# EAGLE board oresat-live-card (EAGLE 9.6.2), part 1 of 2
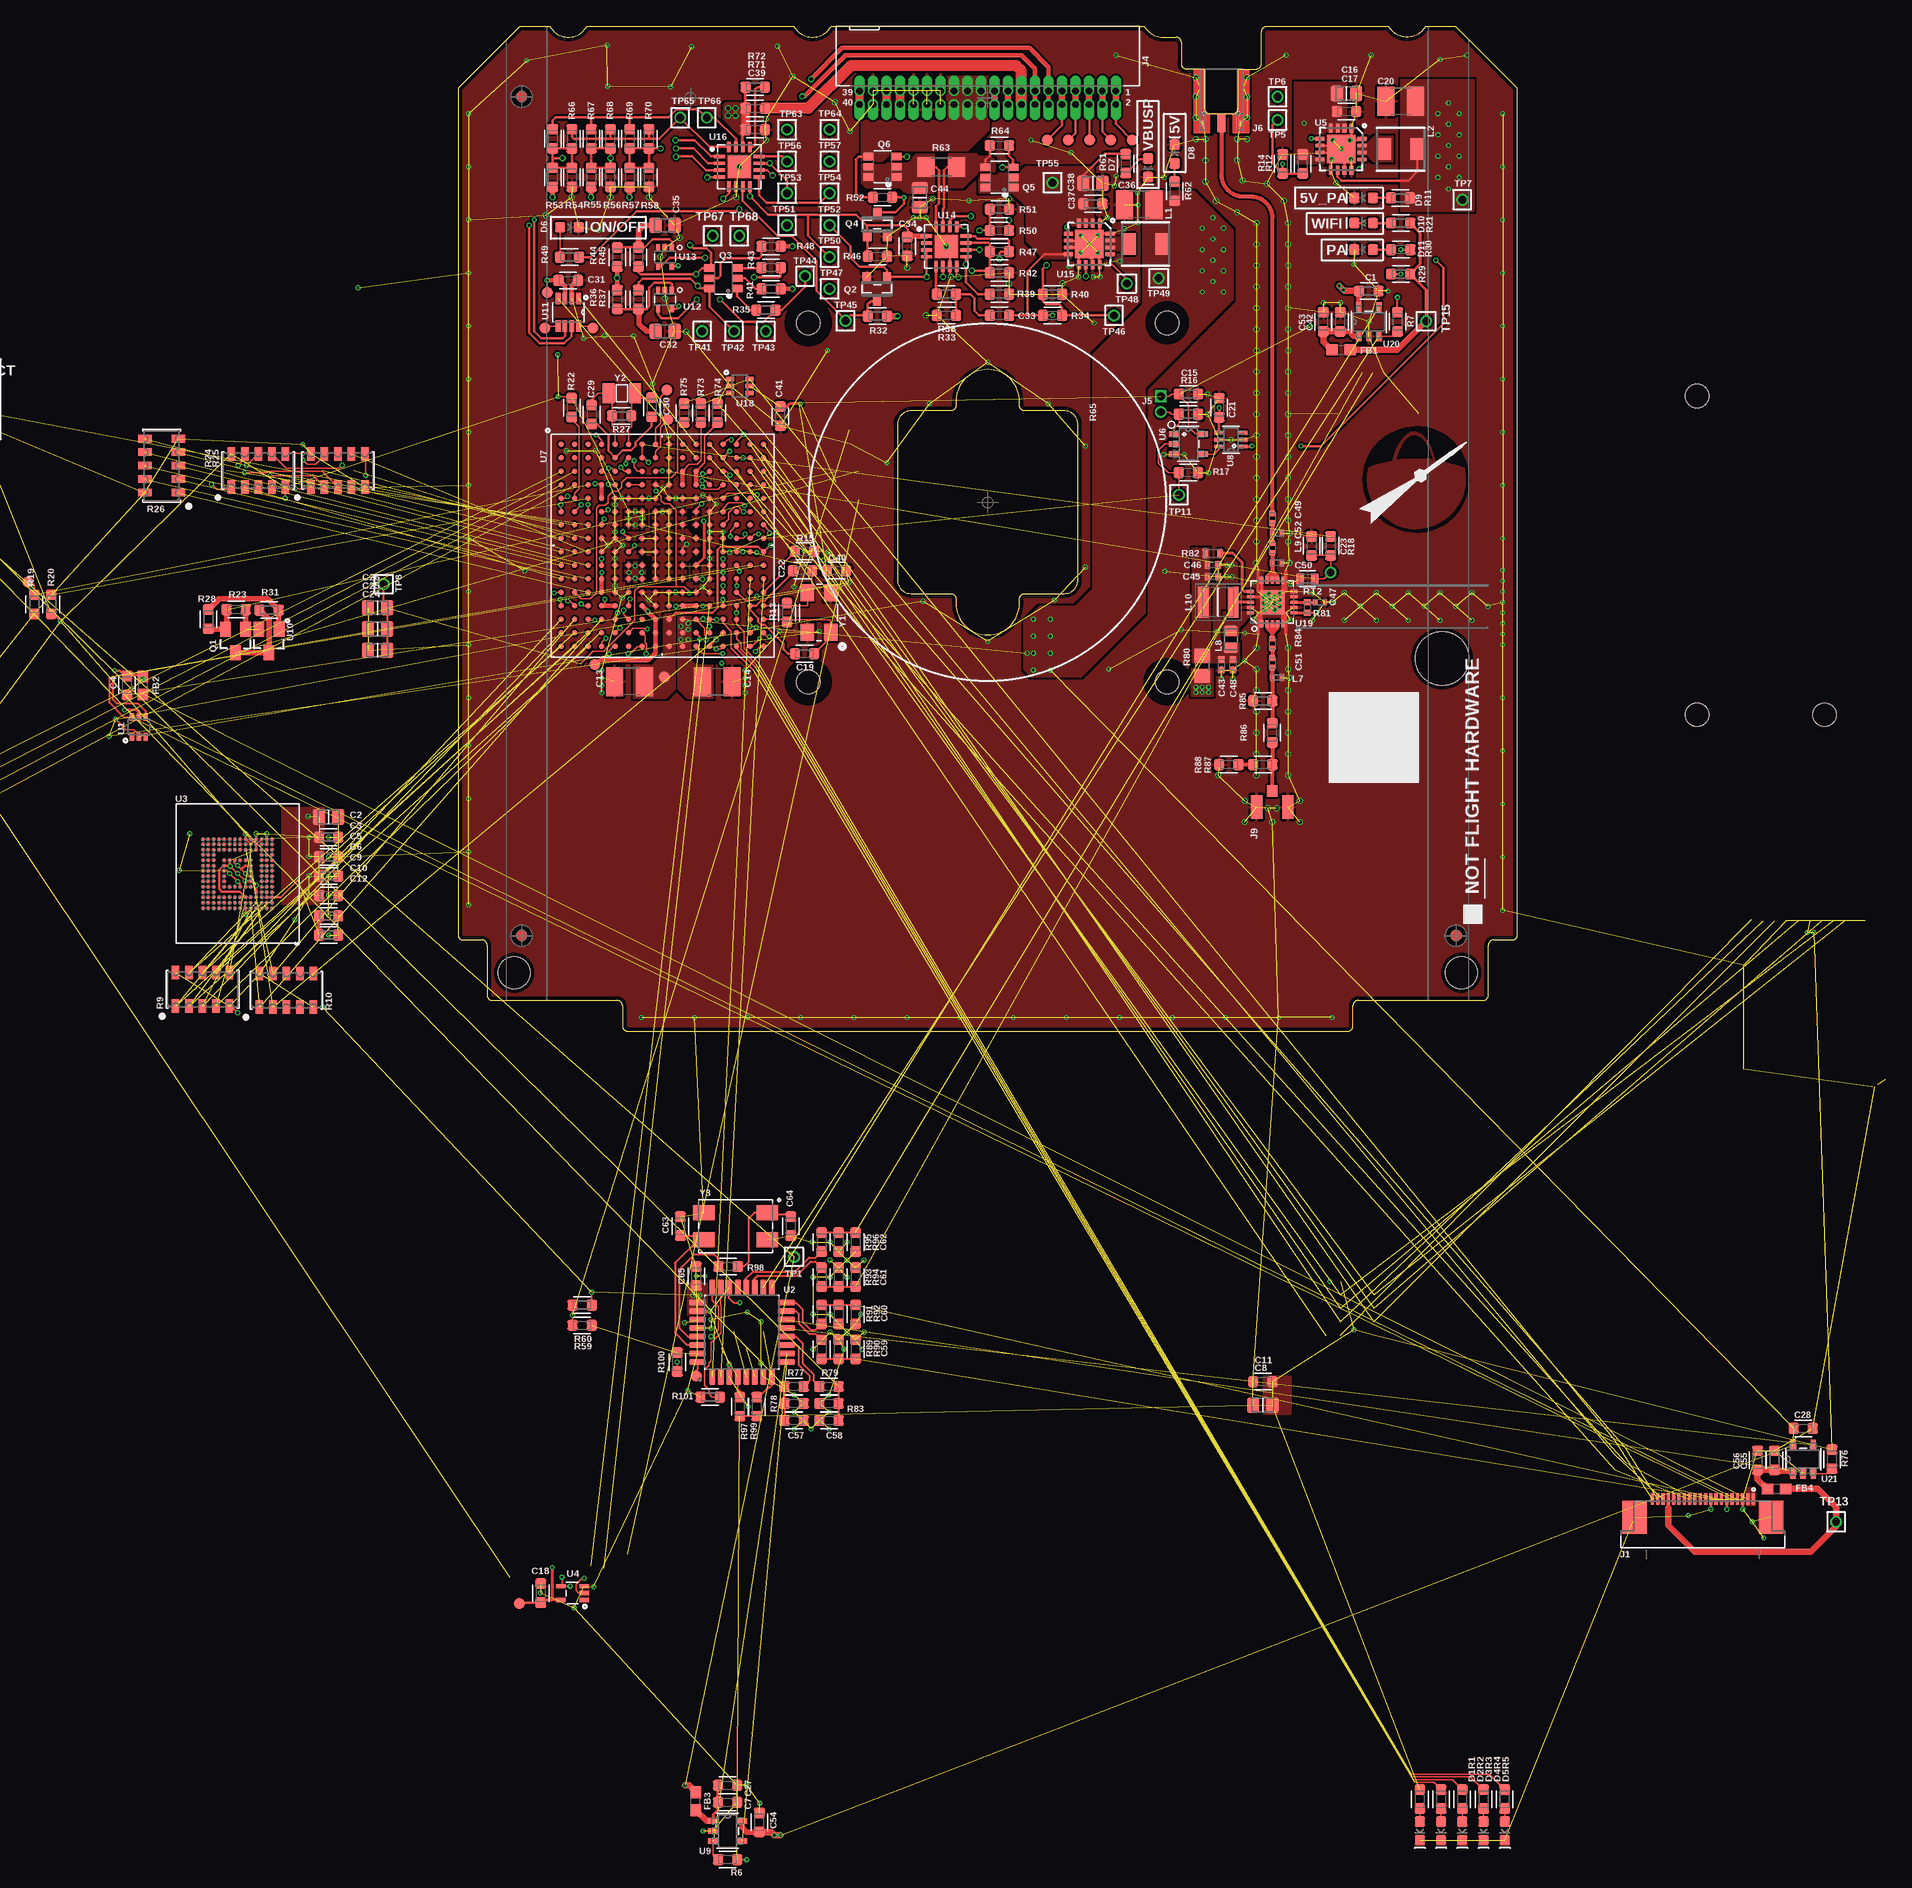
[diagram p11: board, top side]
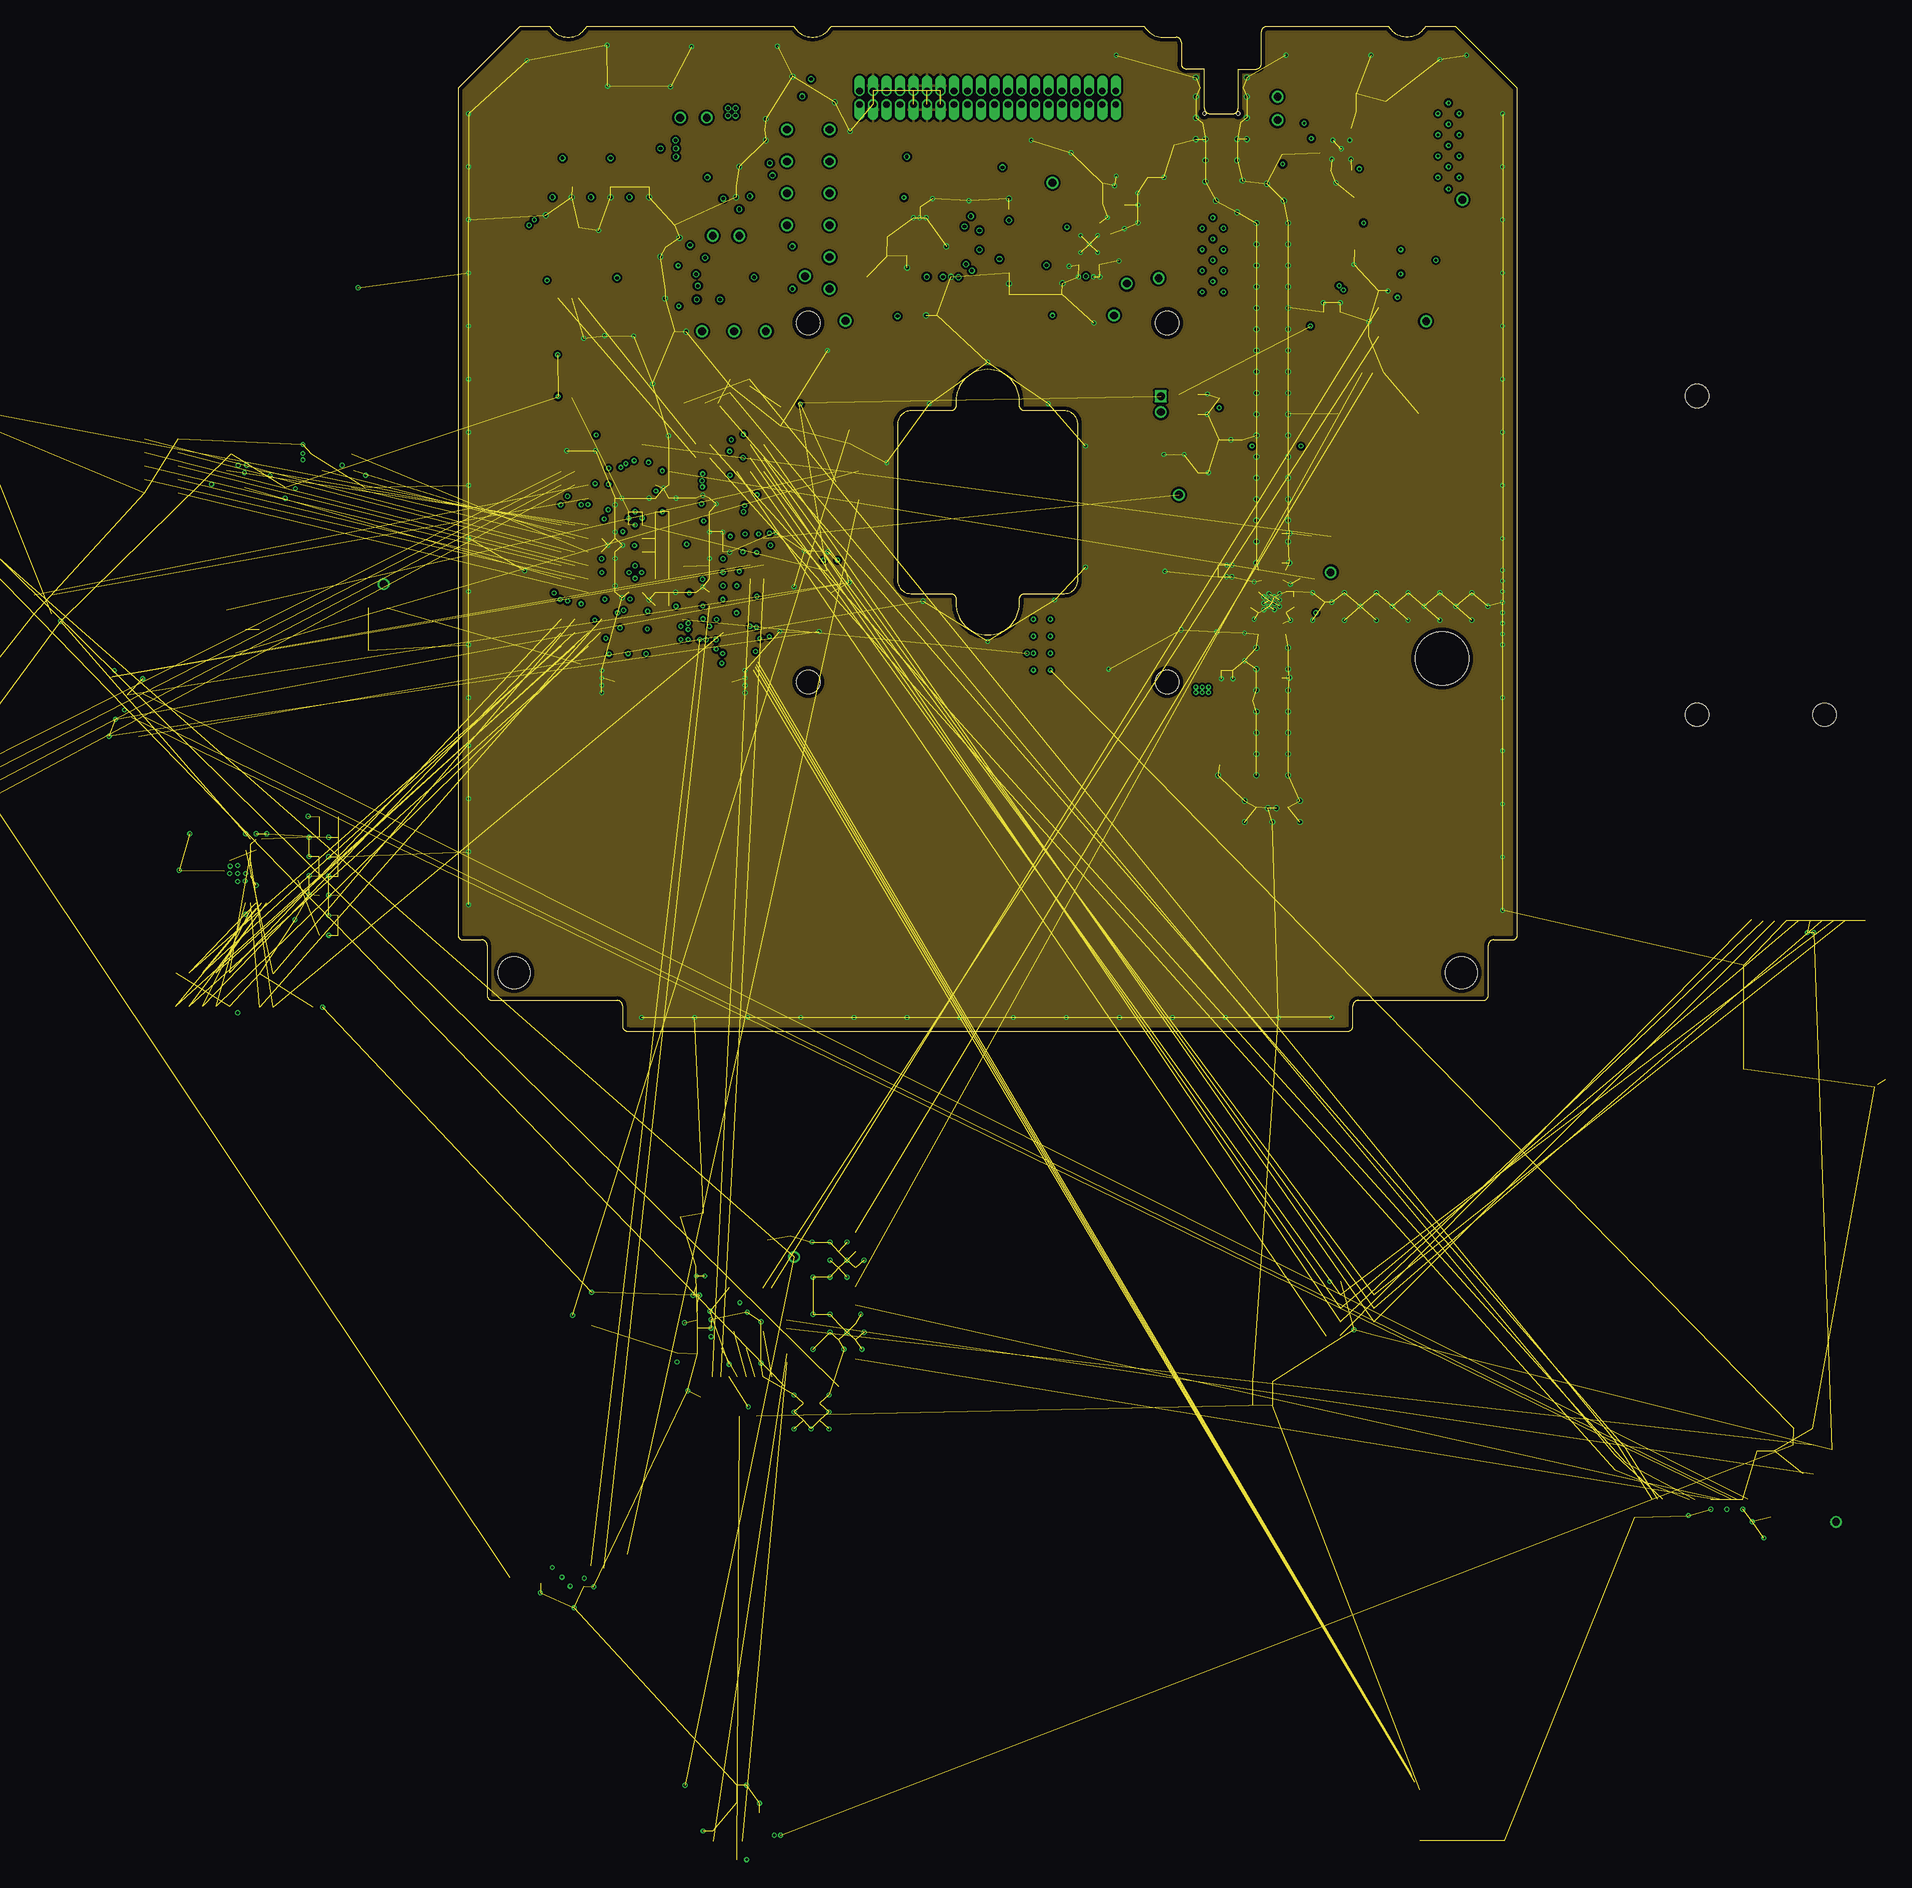
[diagram p12: board, inner layer Route2]
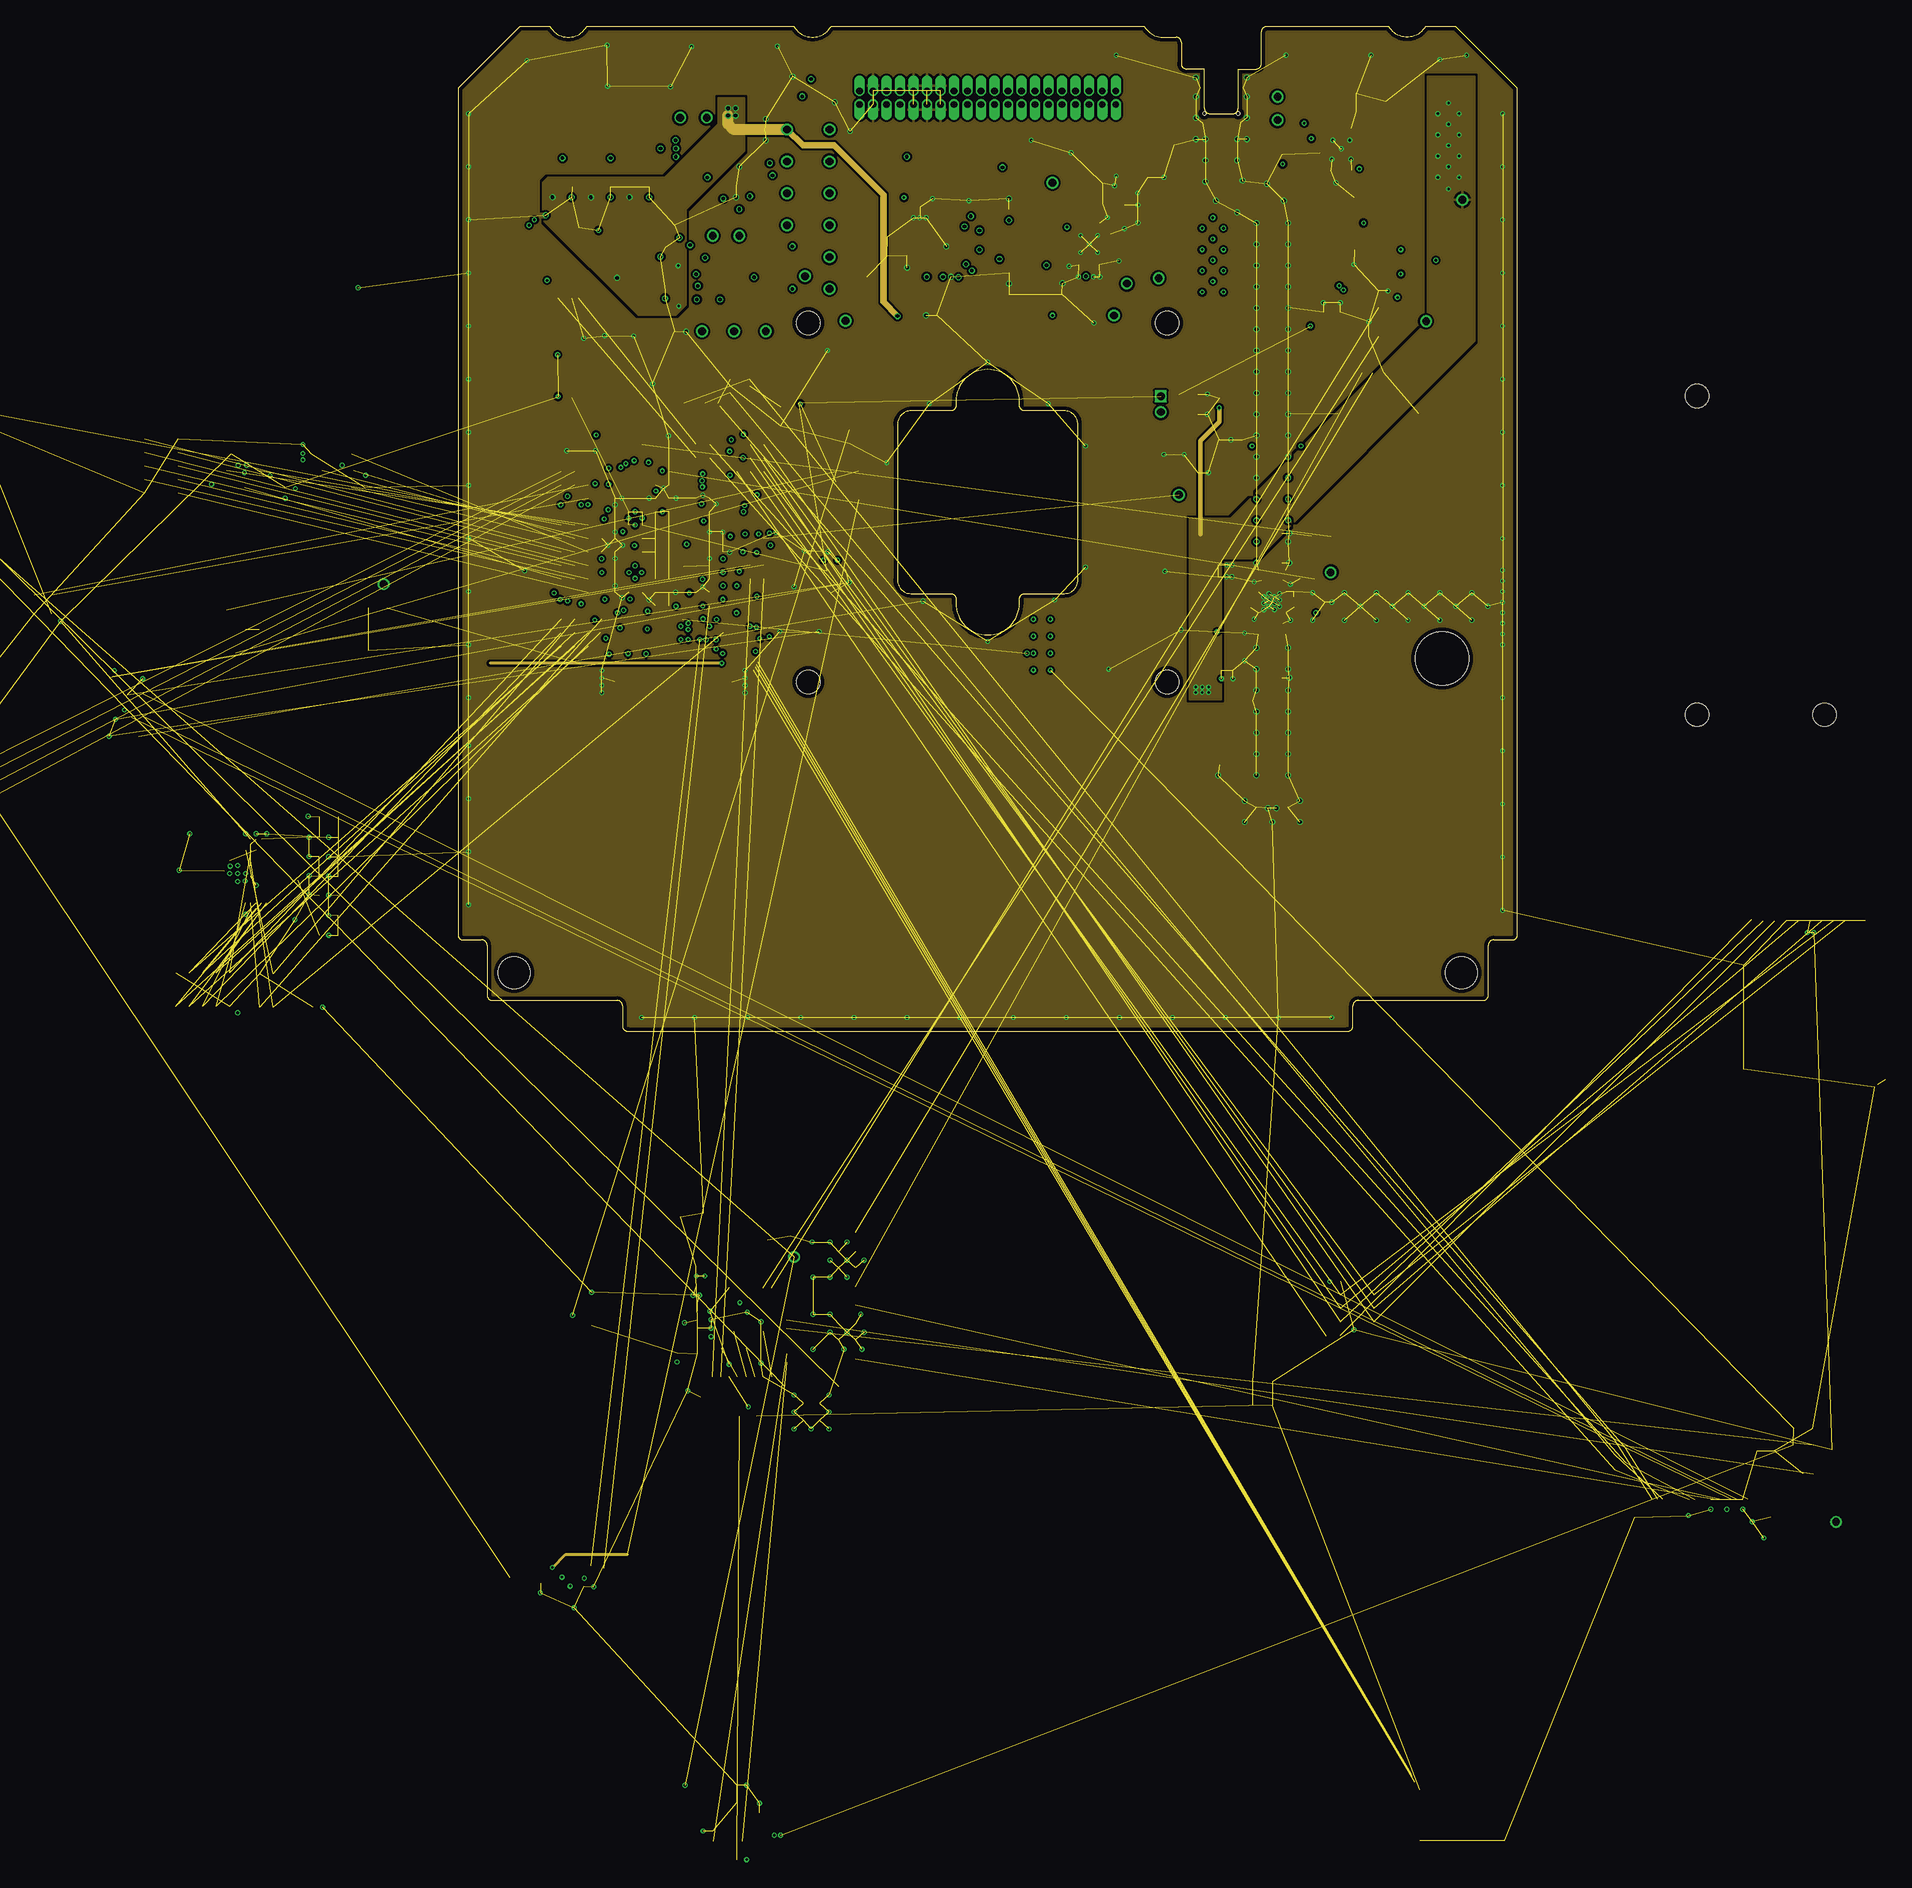
[diagram p13: board, inner layer Route15]
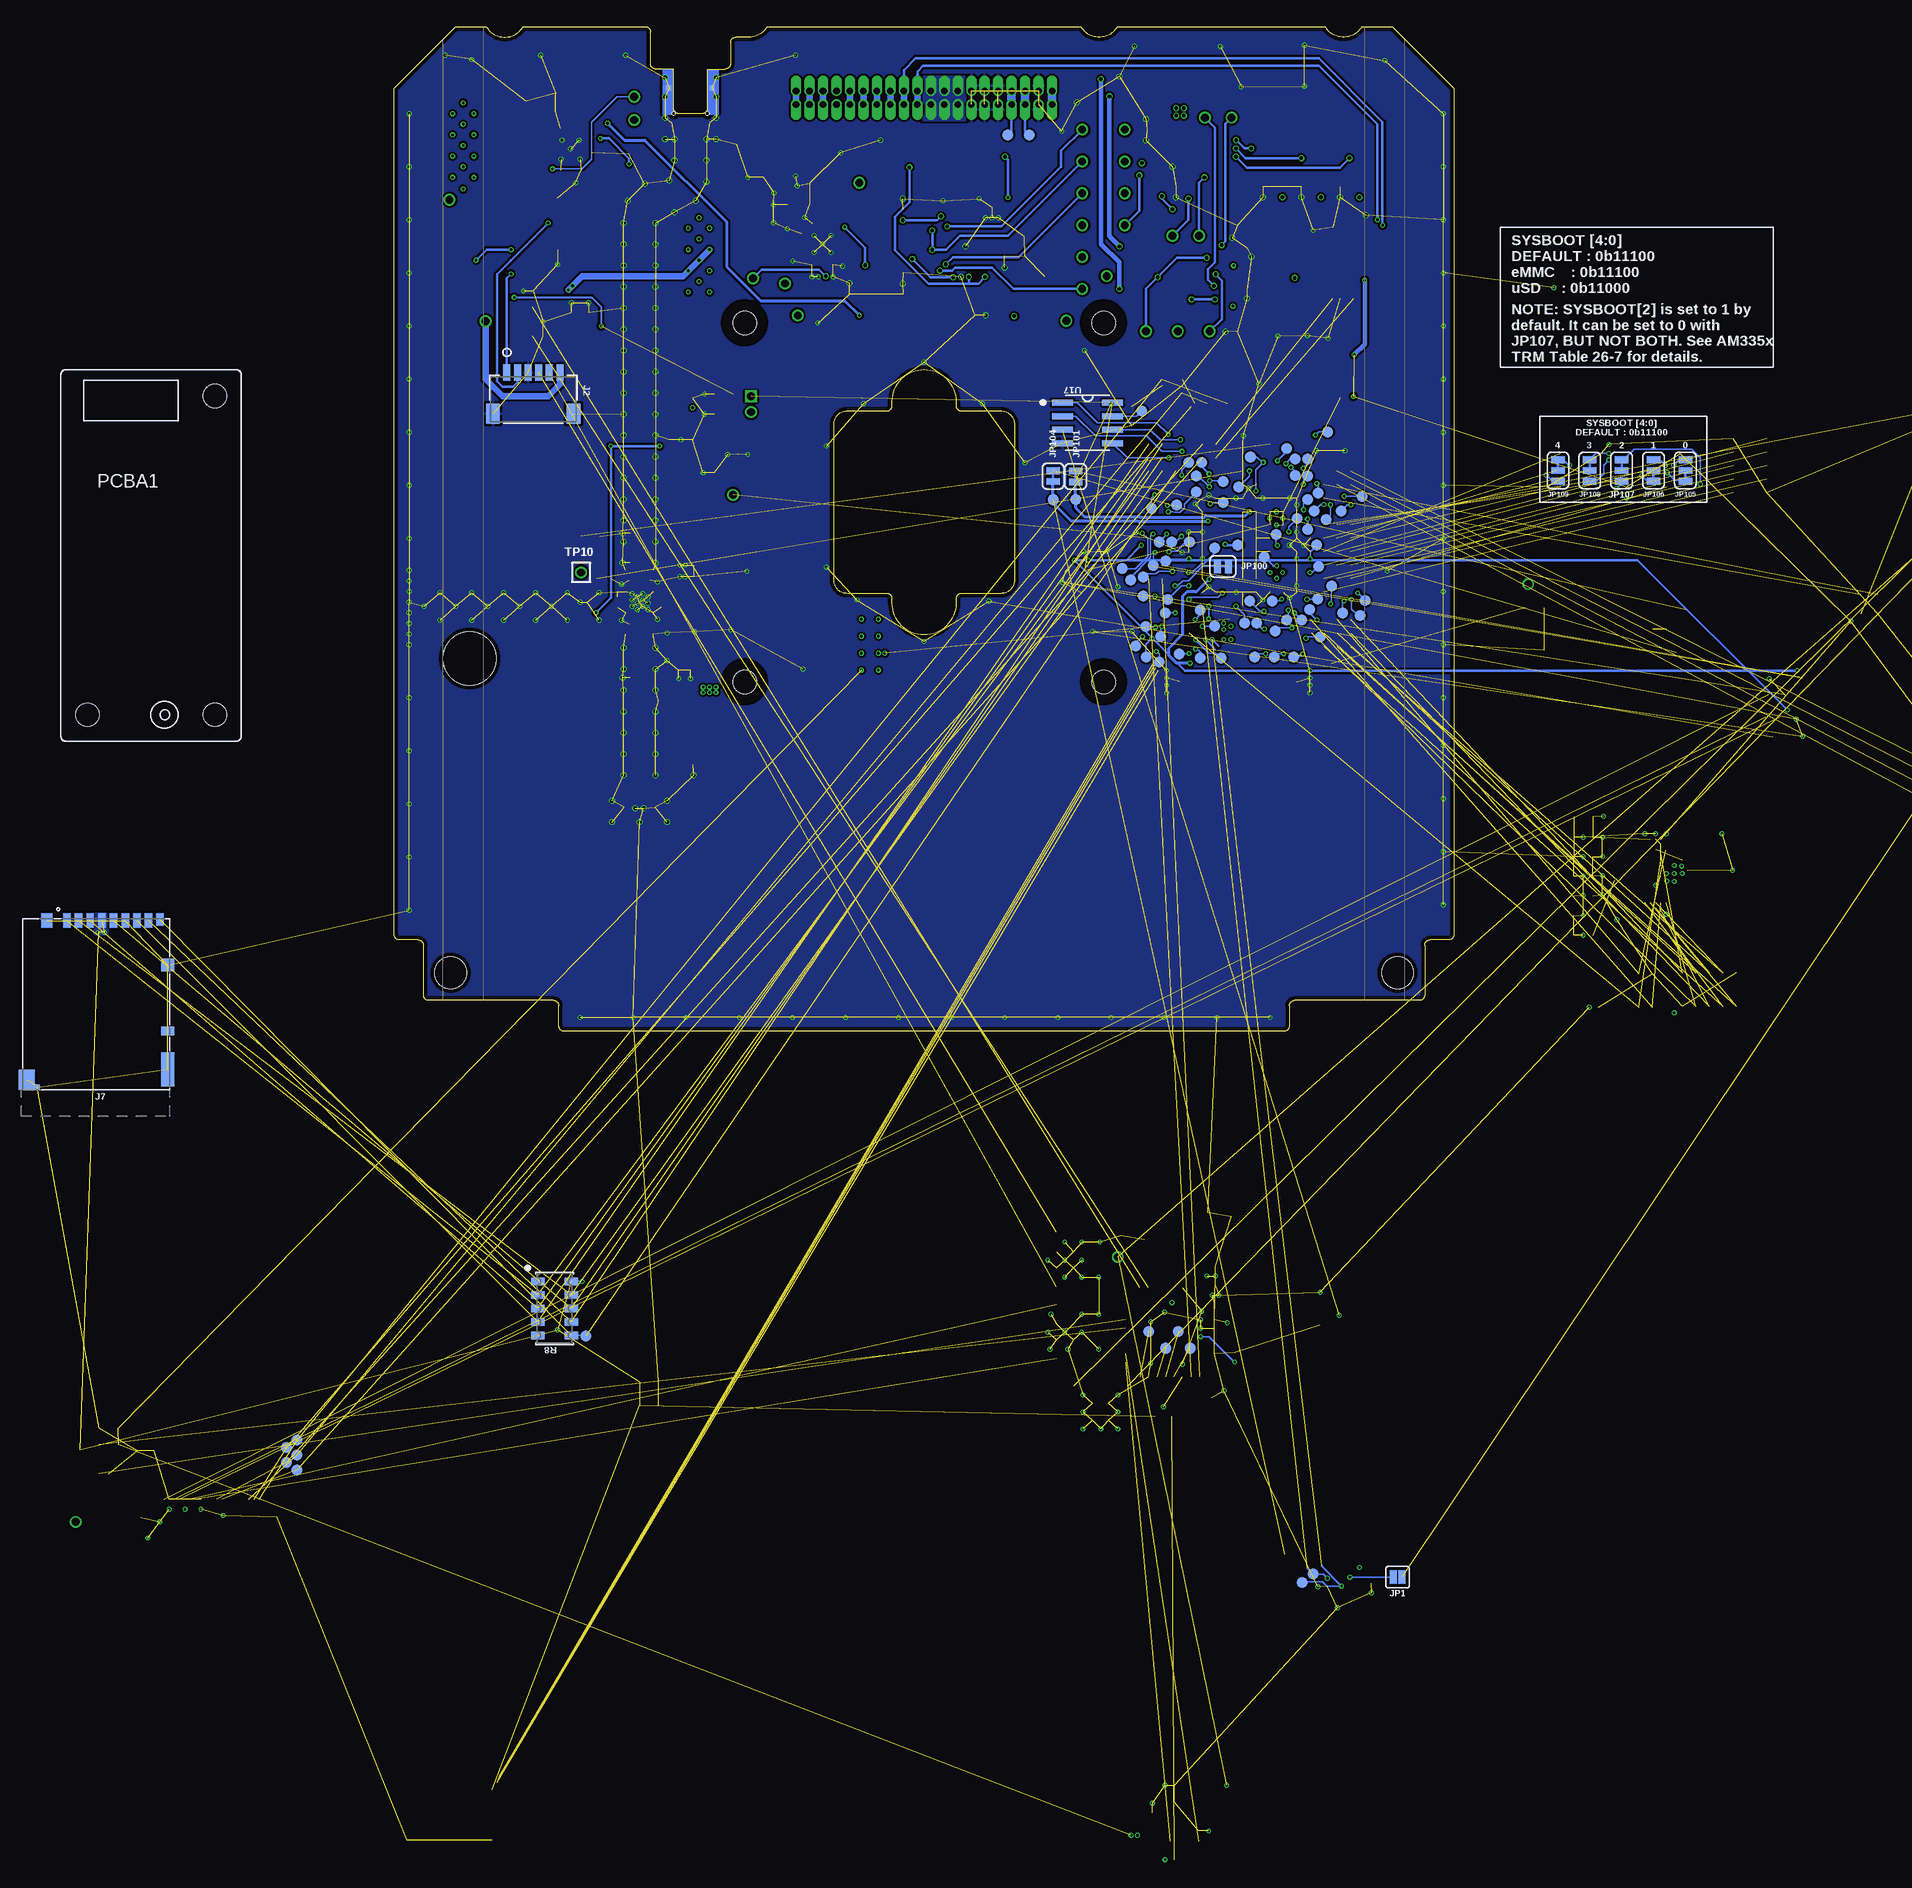
[diagram p14: board, bottom side, seen from below]

Size 99.8 x 94.6 mm. Coordinates in mm from the lower left corner, seen from the top.
Outline: 52.9,59.31 arc180 46.9,59.31
Outline: 46.9,40.31 arc180 52.9,40.31
Outline: 46.9,59.31 46.9,58.91 arc-90 46.4,58.41 42.66,58.41 arc90 41.39,57.14 41.39,42.48 arc90 42.66,41.21 46.4,41.21 arc-90 46.9,40.71 46.9,40.31
Outline: 52.9,40.31 52.9,40.71 arc-90 53.4,41.21 57.12,41.21 arc90 58.39,42.48 58.39,57.14 arc90 57.12,58.41 53.4,58.41 arc-90 52.9,58.91 52.9,59.31
Outline: 46.9,40.31 arc180 52.9,40.31
Outline: 52.9,59.31 arc180 46.9,59.31
Copper layers (1*2*15*16): Top 0.035559375mm / dielectric 0.17018125mm / Route2 0.01778125mm / dielectric 47mil / Route15 0.01778125mm / dielectric 0.17018125mm / Bottom 0.035559375mm
Design rules "oshpark-4layer-tented": minimum track width 5mil, minimum drill 10mil, track to track 5mil, track to pad 5mil, pad to pad 5mil, via to via 5mil, smd to smd 5mil, copper to edge 15mil, drill to drill 6mil, minimum pad ring 4mil, minimum via ring 4mil, stop-mask expansion 2.5mil, vias tented up to drill 20mil, thermal gap 10mil
Net classes: 1 diff pair: width 0.191 mm, clearance 0.191 mm; 2 RF: clearance 0.8 mm
Holes 2.2 mm at 33,66.7 66.8,66.7 66.8,32.9 33,32.9
Holes 5 mm at 92.7,35.1
tRestrict: area 31,30.9 to 35,34.9; area 64.8,30.9 to 68.8,34.9; area 64.8,64.7 to 68.8,68.7; area 31,64.7 to 35,68.7
bRestrict: area 31,30.9 to 35,34.9; area 64.8,30.9 to 68.8,34.9; area 64.8,64.7 to 68.8,68.7; area 31,64.7 to 35,68.7

## Footprints (pad centres in the part's own frame; a part is rotated, then mirrored left to right if it is on the bottom)
.0603-A = smd 1 x 1.05: 1 -0.9,0; 2 0.9,0
.0805-B = smd 1.15 x 1.45: 1 -0.9,0; 2 0.9,0
C1210 = smd 1.6 x 2.7: 1 -1.4,0; 2 1.4,0
.0805-B-NOSILK = smd 1.15 x 1.45: 1 -0.9,0; 2 0.9,0
.0402-B-NOSILK = smd 0.6 x 0.7: 1 -0.5,0; 2 0.5,0
.0402-C-NOSILK = smd 0.5 x 0.6: 1 -0.45,0; 2 0.45,0
LED-0603 = smd 1 x 1: A -0.877,0; C 0.877,0
0603 = smd 1.1 x 1: 1 -0.85,0; 2 0.85,0
TE_2-1734592-0 = smd 0.3 x 1.1: 1 -4.75,-1.7; 2 -4.25,-1.7; 3 -3.75,-1.7; 4 -3.25,-1.7; 5 -2.75,-1.7; 6 -2.25,-1.7; 7 -1.75,-1.7; 8 -1.25,-1.7; 9 -0.75,-1.7; 10 -0.25,-1.7; 11 0.25,-1.7; 12 0.75,-1.7; 13 1.25,-1.7; 14 1.75,-1.7; 15 2.25,-1.7; 16 2.75,-1.7; 17 3.25,-1.7; 18 3.75,-1.7; 19 4.25,-1.7; 20 4.75,-1.7 | smd 2.3 x 3.1: PAD1 6.42,0; PAD2 -6.42,0
CONN_SM06B-SRSS-TB_JST = smd 0.66 x 1.549: 1 -2.5,2.507; 2 -1.5,2.507; 3 -0.5,2.507; 4 0.5,2.507; 5 1.5,2.507; 6 2.5,2.507 | smd 1.295 x 1.905: 7 -3.8,-1.368; 8 3.8,-1.368
J-SAMTEC-TFM-120-X1-XXX-D-RA = drill 0.635 pad 0.965 offset: 1 12.065,0.635; 2 12.065,-0.635; 3 10.795,0.635; 4 10.795,-0.635; 5 9.525,0.635; 6 9.525,-0.635; 7 8.255,0.635; 8 8.255,-0.635; 9 6.985,0.635; 10 6.985,-0.635; 11 5.715,0.635; 12 5.715,-0.635; 13 4.445,0.635; 14 4.445,-0.635; 15 3.175,0.635; 16 3.175,-0.635; 17 1.905,0.635; 18 1.905,-0.635; 19 0.635,0.635; 20 0.635,-0.635; 21 -0.635,0.635; 22 -0.635,-0.635; 23 -1.905,0.635; 24 -1.905,-0.635; 25 -3.175,0.635; 26 -3.175,-0.635; 27 -4.445,0.635; 28 -4.445,-0.635; 29 -5.715,0.635; 30 -5.715,-0.635; 31 -6.985,0.635; 32 -6.985,-0.635; 33 -8.255,0.635; 34 -8.255,-0.635; 35 -9.525,0.635; 36 -9.525,-0.635; 37 -10.795,0.635; 38 -10.795,-0.635; 39 -12.065,0.635; 40 -12.065,-0.635
2X1 = drill 0.737 square: P$1 -0.8,0 | drill 0.737: P$2 0.7,0
J-MOLEX-SMPM-073300-003X = smd 0.508 x 0.508: P$1 -1.778,-5.08; P$2 1.778,-5.08 | smd 0.508 x 0.508 bottom: P$3 -2.032,-1.778; P$4 2.032,-1.778 | smd 0.762 x 1.778: RF 0,-5.08
DM3BT-DSF-PEJS = smd 0.7 x 1.4: 1 -3.2,15.95; 2 -2.1,15.95; 3 -1,15.95; 4 0.1,15.95; 5 1.2,15.95; 6 2.3,15.95; 7 3.4,15.95; 8 4.5,15.95 | smd 0.7 x 1.2: CD 5.55,16.05 | smd 0.5 x 0.5: CGND1 -6,0.25 | smd 1.5 x 1.9: CGND2 -7,0.95 | smd 0.21 x 0.21 rotated 45: CGND3 -6.25,0.5 | smd 1 x 1.4: CGND4 -5.1,15.95 | smd 1.2 x 1.2: CGND5 6.3,11.75 | smd 1.2 x 3.2: CGND6 6.3,1.95 | smd 1.2 x 0.8: GND 6.3,5.55
CON10_2X5_DUK_FTSH = smd 0.762 x 2.794: 1 -2.54,-2.032; 2 -2.54,2.032; 3 -1.27,-2.032; 4 -1.27,2.032; 5 0,-2.032; 6 0,2.032; 7 1.27,-2.032; 8 1.27,2.032; 9 2.54,-2.032; 10 2.54,2.032
U.FL-R-SMT = smd 1 x 1.05: 1 0,1.525 | smd 1.05 x 2.2: 2 -1.475,0; 3 1.475,0
SMT-JUMPER_2_NO_SILK = smd 0.635 x 1.27: 1 -0.406,0; 2 0.406,0
SMT-JUMPER_2_NC_TRACE_SILK = smd 0.635 x 1.27: 1 -0.508,0; 2 0.508,0
SMT-JUMPER_3_1-NC_TRACE_SILK = smd 0.635 x 1.27: 1 -1.016,0; 2 0,0; 3 1.016,0
ECS-MPI4040 = smd 2 x 1.3: 1 0,1.575; 2 0,-1.575
.0805-C-NOSILK = smd 0.95 x 1.35: 1 -0.8,0; 2 0.8,0
INDC2928X203N = smd 1 x 2.95: 1 -1.4,0; 2 1.4,0
ORESAT-CARD-V1.3-GENERIC-1RF-POS1 = hole 0.32: 70.31,86.4; 73.49,86.4 | hole 3: 94.5,5.5; 5.3,5.5
WF-NP9202 = hole 2.2: -6,-15; 6,-15; 6,15
SOT23-BEC = smd 1 x 1.4: B -0.95,-1.1; C 0,1.1; E 0.95,-1.1
SOT23 = smd 0.787 x 0.889: 1 -0.953,-1.143; 2 0.953,-1.143; 3 0,1.143
SOT23-6 = smd 0.7 x 1: 1 -0.95,-1.3; 2 0,-1.3; 3 0.95,-1.3; 4 0.95,1.3; 5 0,1.3; 6 -0.95,1.3
ARRAY_EXBA-M = smd 1.27 x 0.711: 1 -1.575,2.54; 2 -1.575,1.27; 3 -1.575,0; 4 -1.575,-1.27; 5 -1.575,-2.54; 6 1.575,-2.54; 7 1.575,-1.27; 8 1.575,0; 9 1.575,1.27; 10 1.575,2.54
R1206 = smd 1.6 x 1.803: 1 -1.422,0; 2 1.422,0
R0805 = smd 1.3 x 1.5: 1 -0.95,0; 2 0.95,0
.0603-C-NOSILK = smd 0.6 x 0.9: 1 -0.7,0; 2 0.7,0
0603-THERMISTOR-B = smd 0.7 x 0.95: 1 -0.675,0; 2 0.675,0
2MM-TEST-POINT = drill 0.737: 1 0,0
PAD.03X.04 = smd 1.016 x 1.016: 1 0,0
SC70-6 = smd 0.4 x 0.75: 1 -0.65,-0.925; 2 0,-0.925; 3 0.65,-0.925; 4 0.65,0.925; 5 0,0.925; 6 -0.65,0.925
QFP80P900X900X160-32N = smd 1.56 x 0.54: 1 -4.18,2.8; 2 -4.18,2; 3 -4.18,1.2; 4 -4.18,0.4; 5 -4.18,-0.4; 6 -4.18,-1.2; 7 -4.18,-2; 8 -4.18,-2.8; 17 4.18,-2.8; 18 4.18,-2; 19 4.18,-1.2; 20 4.18,-0.4; 21 4.18,0.4; 22 4.18,1.2; 23 4.18,2; 24 4.18,2.8 | smd 0.54 x 1.56: 9 -2.8,-4.18; 10 -2,-4.18; 11 -1.2,-4.18; 12 -0.4,-4.18; 13 0.4,-4.18; 14 1.2,-4.18; 15 2,-4.18; 16 2.8,-4.18; 25 2.8,4.18; 26 2,4.18; 27 1.2,4.18; 28 0.4,4.18; 29 -0.4,4.18; 30 -1.2,4.18; 31 -2,4.18; 32 -2.8,4.18
BGA-153(11.5X13)(EMMC-BA) = smd 0.28 x 0.28: A1 -3.25,3.25; A2 -2.75,3.25; A3 -2.25,3.25; A4 -1.75,3.25; A5 -1.25,3.25; A6 -0.75,3.25; A7 -0.25,3.25; A8 0.25,3.25; A9 0.75,3.25; A10 1.25,3.25; A11 1.75,3.25; A12 2.25,3.25; A13 2.75,3.25; A14 3.25,3.25; B1 -3.25,2.75; B2 -2.75,2.75; B3 -2.25,2.75; B4 -1.75,2.75; B5 -1.25,2.75; B6 -0.75,2.75; B7 -0.25,2.75; B8 0.25,2.75; B9 0.75,2.75; B10 1.25,2.75; B11 1.75,2.75; B12 2.25,2.75; B13 2.75,2.75; B14 3.25,2.75; C1 -3.25,2.25; C2 -2.75,2.25; C3 -2.25,2.25; C4 -1.75,2.25; C5 -1.25,2.25; C6 -0.75,2.25; C7 -0.25,2.25; C8 0.25,2.25; C9 0.75,2.25; C10 1.25,2.25; C11 1.75,2.25; C12 2.25,2.25; C13 2.75,2.25; C14 3.25,2.25; D1 -3.25,1.75; D2 -2.75,1.75; D3 -2.25,1.75; D4 -1.75,1.75; D12 2.25,1.75; D13 2.75,1.75; D14 3.25,1.75; E1 -3.25,1.25; E2 -2.75,1.25; E3 -2.25,1.25; E5 -1.25,1.25; E6 -0.75,1.25; E7 -0.25,1.25; E8 0.25,1.25; E9 0.75,1.25; E10 1.25,1.25; E12 2.25,1.25; E13 2.75,1.25; E14 3.25,1.25; F1 -3.25,0.75; F2 -2.75,0.75; F3 -2.25,0.75; F5 -1.25,0.75; F10 1.25,0.75; F12 2.25,0.75; F13 2.75,0.75; F14 3.25,0.75; G1 -3.25,0.25; G2 -2.75,0.25; G3 -2.25,0.25; G5 -1.25,0.25; G10 1.25,0.25; G12 2.25,0.25; G13 2.75,0.25; G14 3.25,0.25; H1 -3.25,-0.25; H2 -2.75,-0.25; H3 -2.25,-0.25; H5 -1.25,-0.25; H10 1.25,-0.25; H12 2.25,-0.25; H13 2.75,-0.25; H14 3.25,-0.25; J1 -3.25,-0.75; J2 -2.75,-0.75; J3 -2.25,-0.75; J5 -1.25,-0.75; J10 1.25,-0.75; J12 2.25,-0.75; J13 2.75,-0.75; J14 3.25,-0.75; K1 -3.25,-1.25; K2 -2.75,-1.25; K3 -2.25,-1.25; K5 -1.25,-1.25; K6 -0.75,-1.25; K7 -0.25,-1.25; K8 0.25,-1.25; K9 0.75,-1.25; K10 1.25,-1.25; K12 2.25,-1.25; K13 2.75,-1.25; K14 3.25,-1.25; L1 -3.25,-1.75; L2 -2.75,-1.75; L3 -2.25,-1.75; L12 2.25,-1.75; L13 2.75,-1.75; L14 3.25,-1.75; M1 -3.25,-2.25; M2 -2.75,-2.25; M3 -2.25,-2.25; M4 -1.75,-2.25; M5 -1.25,-2.25; M6 -0.75,-2.25; M7 -0.25,-2.25; M8 0.25,-2.25; M9 0.75,-2.25; M10 1.25,-2.25; M11 1.75,-2.25; M12 2.25,-2.25; M13 2.75,-2.25; M14 3.25,-2.25; N1 -3.25,-2.75; N2 -2.75,-2.75; N3 -2.25,-2.75; N4 -1.75,-2.75; N5 -1.25,-2.75; N6 -0.75,-2.75; N7 -0.25,-2.75; N8 0.25,-2.75; N9 0.75,-2.75; N10 1.25,-2.75; N11 1.75,-2.75; N12 2.25,-2.75; N13 2.75,-2.75; N14 3.25,-2.75; P1 -3.25,-3.25; P2 -2.75,-3.25; P3 -2.25,-3.25; P4 -1.75,-3.25; P5 -1.25,-3.25; P6 -0.75,-3.25; P7 -0.25,-3.25; P8 0.25,-3.25; P9 0.75,-3.25; P10 1.25,-3.25; P11 1.75,-3.25; P12 2.25,-3.25; P13 2.75,-3.25; P14 3.25,-3.25
C70(TI-DCK) = smd 0.4 x 0.9: 1 0.65,1.1; 2 0,1.1; 3 -0.65,1.1; 4 -0.65,-1.1; 5 0.65,-1.1
S-PVQFN-16 = smd 0.85 x 0.35: 1 -1.975,0.975; 2 -1.975,0.325; 3 -1.975,-0.325; 4 -1.975,-0.975; 9 1.975,-0.975; 10 1.975,-0.325; 11 1.975,0.325; 12 1.975,0.975 | smd 0.35 x 0.85: 5 -0.975,-1.975; 6 -0.325,-1.975; 7 0.325,-1.975; 8 0.975,-1.975; 13 0.975,1.975; 14 0.325,1.975; 15 -0.325,1.975; 16 -0.975,1.975 | smd 2.7 x 2.7: PAD 0,0
DBV5 = smd 0.972 x 0.508: 1 -1.362,0.95; 2 -1.362,0; 3 -1.362,-0.95; 4 1.362,-0.95; 5 1.362,0.95
OSD335X-BGA-256 = smd 0.5 x 0.5: A1 -9.525,-9.525; A2 -9.525,-8.255; A3 -9.525,-6.985; A4 -9.525,-5.715; A5 -9.525,-4.445; A6 -9.525,-3.175; A7 -9.525,-1.905; A8 -9.525,-0.635; A9 -9.525,0.635; A10 -9.525,1.905; A11 -9.525,3.175; A12 -9.525,4.445; A13 -9.525,5.715; A14 -9.525,6.985; A15 -9.525,8.255; A16 -9.525,9.525; B1 -8.255,-9.525; B2 -8.255,-8.255; B3 -8.255,-6.985; B4 -8.255,-5.715; B5 -8.255,-4.445; B6 -8.255,-3.175; B7 -8.255,-1.905; B8 -8.255,-0.635; B9 -8.255,0.635; B10 -8.255,1.905; B11 -8.255,3.175; B12 -8.255,4.445; B13 -8.255,5.715; B14 -8.255,6.985; B15 -8.255,8.255; B16 -8.255,9.525; C1 -6.985,-9.525; C2 -6.985,-8.255; C3 -6.985,-6.985; C4 -6.985,-5.715; C5 -6.985,-4.445; C6 -6.985,-3.175; C7 -6.985,-1.905; C8 -6.985,-0.635; C9 -6.985,0.635; C10 -6.985,1.905; C11 -6.985,3.175; C12 -6.985,4.445; C13 -6.985,5.715; C14 -6.985,6.985; C15 -6.985,8.255; C16 -6.985,9.525; D1 -5.715,-9.525; D2 -5.715,-8.255; D3 -5.715,-6.985; D4 -5.715,-5.715; D5 -5.715,-4.445; D6 -5.715,-3.175; D7 -5.715,-1.905; D8 -5.715,-0.635; D9 -5.715,0.635; D10 -5.715,1.905; D11 -5.715,3.175; D12 -5.715,4.445; D13 -5.715,5.715; D14 -5.715,6.985; D15 -5.715,8.255; D16 -5.715,9.525; E1 -4.445,-9.525; E2 -4.445,-8.255; E3 -4.445,-6.985; E4 -4.445,-5.715; E5 -4.445,-4.445; E6 -4.445,-3.175; E7 -4.445,-1.905; E8 -4.445,-0.635; E9 -4.445,0.635; E10 -4.445,1.905; E11 -4.445,3.175; E12 -4.445,4.445; E13 -4.445,5.715; E14 -4.445,6.985; E15 -4.445,8.255; E16 -4.445,9.525; F1 -3.175,-9.525; F2 -3.175,-8.255; F3 -3.175,-6.985; F4 -3.175,-5.715; F5 -3.175,-4.445; F6 -3.175,-3.175; F7 -3.175,-1.905; F8 -3.175,-0.635; F9 -3.175,0.635; F10 -3.175,1.905; F11 -3.175,3.175; F12 -3.175,4.445; F13 -3.175,5.715; F14 -3.175,6.985; F15 -3.175,8.255; F16 -3.175,9.525; G1 -1.905,-9.525; G2 -1.905,-8.255; G3 -1.905,-6.985; G4 -1.905,-5.715; G5 -1.905,-4.445; G6 -1.905,-3.175; G7 -1.905,-1.905; G8 -1.905,-0.635; G9 -1.905,0.635; G10 -1.905,1.905; G11 -1.905,3.175; G12 -1.905,4.445; G13 -1.905,5.715; G14 -1.905,6.985; G15 -1.905,8.255; G16 -1.905,9.525; H1 -0.635,-9.525; H2 -0.635,-8.255; H3 -0.635,-6.985; H4 -0.635,-5.715; H5 -0.635,-4.445; H6 -0.635,-3.175; H7 -0.635,-1.905; H8 -0.635,-0.635; H9 -0.635,0.635; H10 -0.635,1.905; H11 -0.635,3.175; H12 -0.635,4.445; H13 -0.635,5.715; H14 -0.635,6.985; H15 -0.635,8.255; H16 -0.635,9.525; J1 0.635,-9.525; J2 0.635,-8.255; J3 0.635,-6.985; J4 0.635,-5.715; J5 0.635,-4.445; J6 0.635,-3.175; J7 0.635,-1.905; J8 0.635,-0.635; J9 0.635,0.635; J10 0.635,1.905; J11 0.635,3.175; J12 0.635,4.445; J13 0.635,5.715; J14 0.635,6.985; J15 0.635,8.255; J16 0.635,9.525; K1 1.905,-9.525; K2 1.905,-8.255; K3 1.905,-6.985; K4 1.905,-5.715; K5 1.905,-4.445; K6 1.905,-3.175; K7 1.905,-1.905; K8 1.905,-0.635; K9 1.905,0.635; K10 1.905,1.905; K11 1.905,3.175; K12 1.905,4.445; K13 1.905,5.715; K14 1.905,6.985; K15 1.905,8.255; K16 1.905,9.525; L1 3.175,-9.525; L2 3.175,-8.255; L3 3.175,-6.985; L4 3.175,-5.715; L5 3.175,-4.445; L6 3.175,-3.175; L7 3.175,-1.905; L8 3.175,-0.635; L9 3.175,0.635; L10 3.175,1.905; L11 3.175,3.175; L12 3.175,4.445; L13 3.175,5.715; L14 3.175,6.985; L15 3.175,8.255; L16 3.175,9.525; M1 4.445,-9.525; M2 4.445,-8.255; M3 4.445,-6.985; M4 4.445,-5.715; M5 4.445,-4.445; M6 4.445,-3.175; M7 4.445,-1.905; M8 4.445,-0.635; M9 4.445,0.635; M10 4.445,1.905; M11 4.445,3.175; M12 4.445,4.445; M13 4.445,5.715; M14 4.445,6.985; M15 4.445,8.255; M16 4.445,9.525; N1 5.715,-9.525; N2 5.715,-8.255; N3 5.715,-6.985; N4 5.715,-5.715; N5 5.715,-4.445; N6 5.715,-3.175; N7 5.715,-1.905; N8 5.715,-0.635; N9 5.715,0.635; N10 5.715,1.905; N11 5.715,3.175; N12 5.715,4.445; N13 5.715,5.715; N14 5.715,6.985; N15 5.715,8.255; N16 5.715,9.525; P1 6.985,-9.525; P2 6.985,-8.255; P3 6.985,-6.985; P4 6.985,-5.715; P5 6.985,-4.445; P6 6.985,-3.175; P7 6.985,-1.905; P8 6.985,-0.635; P9 6.985,0.635; P10 6.985,1.905; P11 6.985,3.175; P12 6.985,4.445; P13 6.985,5.715; P14 6.985,6.985; P15 6.985,8.255; P16 6.985,9.525; R1 8.255,-9.525; R2 8.255,-8.255; R3 8.255,-6.985; R4 8.255,-5.715; R5 8.255,-4.445; R6 8.255,-3.175; R7 8.255,-1.905; R8 8.255,-0.635; R9 8.255,0.635; R10 8.255,1.905; R11 8.255,3.175; R12 8.255,4.445; R13 8.255,5.715; R14 8.255,6.985; R15 8.255,8.255; R16 8.255,9.525; T1 9.525,-9.525; T2 9.525,-8.255; T3 9.525,-6.985; T4 9.525,-5.715; T5 9.525,-4.445; T6 9.525,-3.175; T7 9.525,-1.905; T8 9.525,-0.635; T9 9.525,0.635; T10 9.525,1.905; T11 9.525,3.175; T12 9.525,4.445; T13 9.525,5.715; T14 9.525,6.985; T15 9.525,8.255; T16 9.525,9.525
SC-70-6_MCH = smd 0.876 x 0.356: 1 -1.111,0.65; 2 -1.111,0; 3 -1.111,-0.65; 4 1.111,-0.65; 5 1.111,0; 6 1.111,0.65
SOT23-3 = smd 1 x 1.4: 1 -0.95,-1.1; 2 0.95,-1.1; 3 0,1.1
SOT23-8_TI-DCN = smd 0.45 x 1.1: 1 -0.975,-1.3; 2 -0.325,-1.3; 3 0.325,-1.3; 4 0.975,-1.3; 5 0.975,1.3; 6 0.325,1.3; 7 -0.325,1.3; 8 -0.975,1.3
SC70-5 = smd 0.4 x 0.7: 1 -0.65,-0.85; 2 0,-0.85; 3 0.65,-0.85; 4 0.65,0.85; 5 -0.65,0.85
QFN65P400X400X80-17T210 = smd 1.01 x 0.32: 1 -1.86,0.975; 2 -1.86,0.325; 3 -1.86,-0.325; 4 -1.86,-0.975; 9 1.86,-0.975; 10 1.86,-0.325; 11 1.86,0.325; 12 1.86,0.975 | smd 0.32 x 1.01: 5 -0.975,-1.86; 6 -0.325,-1.86; 7 0.325,-1.86; 8 0.975,-1.86; 13 0.975,1.86; 14 0.325,1.86; 15 -0.325,1.86; 16 -0.975,1.86 | smd 2.1 x 2.1: EPAD 0,0
SOIC8 = smd 1.981 x 0.559: 1 -2.362,1.905; 2 -2.362,0.635; 3 -2.362,-0.635; 4 -2.362,-1.905; 5 2.362,-1.905; 6 2.362,-0.635; 7 2.362,0.635; 8 2.362,1.905
QFN50P400X400X102-21N = smd 0.65 x 0.3: 1 -2.05,1; 2 -2.05,0.5; 3 -2.05,0; 4 -2.05,-0.5; 5 -2.05,-1; 11 2.05,-1; 12 2.05,-0.5; 13 2.05,0; 14 2.05,0.5; 15 2.05,1 | smd 0.3 x 0.65: 6 -1,-2.05; 7 -0.5,-2.05; 8 0,-2.05; 9 0.5,-2.05; 10 1,-2.05; 16 1,2.05; 17 0.5,2.05; 18 0,2.05; 19 -0.5,2.05; 20 -1,2.05 | smd 2.25 x 2.25: 21 0,0
3X1 = drill 0.737 square: P$1 -1.4,0 | drill 0.737: P$2 0,0; P$3 1.4,0
5X3.2-4SMD = smd 1.6 x 1.25: 1 -1.85,-1.1; 2 1.85,-1.1; 3 1.85,1.1; 4 -1.85,1.1
CRYSTAL_3.2X1.5 = smd 1.1 x 1.9: P$1 -1.25,0; P$2 1.25,0
ECS_ECS-060-18-20BM-JEN-TR = smd 2 x 1.4: 1 -3,-1.27; 2 3,-1.27; 3 3,1.27; 4 -3,1.27

## Placement (x,y rotation side)
C1  0.1uF  [.0603-A]  85.8,69.7 0 top
C2  10uF  [.0805-B]  -12.18,20.18 0 top  (outside the outline)
C3  1uF  [.0603-A]  -12.18,18.27 0 top  (outside the outline)
C4  0.1uF  [.0603-A]  -31.15,32.56 270 top  (outside the outline)
C5  1uF  [.0603-A]  -12.18,16.43 0 top  (outside the outline)
C6  1uF  [.0603-A]  -12.18,14.61 0 top  (outside the outline)
C7  0.1uF  [.0603-A]  25.4,-72.6 0 top  (outside the outline)
C8  10uF  [.0805-B]  75.8,-35.2 180 top  (outside the outline)
C9  1uF  [.0603-A]  -12.18,12.77 0 top  (outside the outline)
C10  1uF  [.0603-A]  -12.18,10.86 0 top  (outside the outline)
C11  0.1uF  [.0603-A]  75.8,-33 180 top  (outside the outline)
C12  1uF  [.0603-A]  -12.18,9.05 0 top  (outside the outline)
C13  22uF  [C1210]  16.18,32.91 180 top
C14  22uF  [C1210]  24.43,32.91 0 top
C15  100n  [.0603-A]  68.8,60 0 top
C16  10uF  [.0805-B]  83.7,88.3 0 top
C17  1uF  [.0603-A]  83.7,86.6 0 top
C18  0.1uF  [.0603-A]  7.8,-52.9 90 top  (outside the outline)
C19  12pF, 50V  [.0603-A]  32.66,35.54 0 top
C20  22uF  [C1210]  88.8,87.56 180 top
C21  100n  [.0603-A]  71.7,58.7 90 top
C22  12pF, 50V  [.0603-A]  32.46,43.36 0 top
C23  0.1u  [.0603-A]  80.4,45.7 90 top
C24  1nF  [.0805-B]  -7.58,35.88 180 top  (outside the outline)
C25  1nF  [.0805-B]  -7.58,37.88 180 top  (outside the outline)
C26  0.1uF  [.0805-B]  -7.58,39.88 180 top  (outside the outline)
C27  10uF  [.0603-A]  25.4,-71 0 top  (outside the outline)
C28  0.1uF  [.0603-A]  126.7,-37.4 0 top  (outside the outline)
C29  12pF, 50V  [.0603-A]  12.59,58.06 270 top
C30  12pF, 50V  [.0603-A]  18.25,58.76 270 top
C31  0.1uF  [.0603-A]  10.4,70.7 180 top
C32  1uF  [.0805-B-NOSILK]  19.5,65.9 0 top
C33  1uF  [.0603-A]  51,67.4 0 top
C34  1uF  [.0603-A]  42.31,73.9 270 top
C35  1uF  [.0805-B-NOSILK]  19.5,75.9 0 top
C36  22uF  [C1210]  64.16,77.83 180 top
C37  1uF  [.0603-A]  59.8,77.91 0 top
C38  10uF  [.0805-B]  59.79,79.84 0 top
C39  0.1uF  [.0603-A]  28,84.9 180 top
C40  0.1uF  [.0603-A]  35.65,43.36 180 top
C41  0.1uF  [.0603-A]  30.38,57.91 270 top
C42  0.1uF  [.0603-A]  83.1,66.8 90 top
C43  100nF  [.0402-B-NOSILK]  71.9,34.5 270 top
C44  10uF  [.0805-B]  43.5,78.5 270 top
C45  100nF  [.0402-B-NOSILK]  71.1,42.8 0 top
C46  100nF  [.0402-B-NOSILK]  71.1,43.9 0 top
C47  100nF  [.0402-C-NOSILK]  81.2,40.4 0 top
C48  1000pF  [.0402-B-NOSILK]  73,34.5 270 top
C49  100pF  [.0402-C-NOSILK]  76.7,48.3 90 top
C50  3.0pF  [.0402-C-NOSILK]  77.15,44.1 0 top
C51  1.1pF  [.0402-C-NOSILK]  76.7,34.7 90 top
C52  1.6pF  [.0402-C-NOSILK]  77.15,46.9 0 top
C53  10uF  [.0603-A]  81.5,66.8 90 top
C54  0.1uF  [.0603-A]  28.4,-74.5 90 top  (outside the outline)
C55  0.1uF  [.0603-A]  124,-40.4 90 top  (outside the outline)
C56  10uF  [.0603-A]  122.4,-40.4 90 top  (outside the outline)
C57  50pF  [.0603-A]  31.65,-36.65 0 top  (outside the outline)
C58  50pF  [.0603-A]  34.95,-36.65 180 top  (outside the outline)
C59  50pF  [.0603-A]  37.45,-29.95 90 top  (outside the outline)
C60  50pF  [.0603-A]  37.45,-26.65 270 top  (outside the outline)
C61  50pF  [.0603-A]  37.45,-23.15 90 top  (outside the outline)
C62  50pF  [.0603-A]  37.45,-19.85 270 top  (outside the outline)
C63  20pF  [.0603-A]  20.95,-18.35 90 top  (outside the outline)
C64  20pF  [.0603-A]  31.35,-18.35 270 top  (outside the outline)
C65  4.7uF  [.0603-A]  22.45,-23.05 90 top  (outside the outline)
D1  GREEN  [LED-0603]  90.6,-75.3 270 top  (outside the outline)
D2  BLUE  [LED-0603]  92.6,-75.3 270 top  (outside the outline)
D3  BLUE  [LED-0603]  94.6,-75.3 270 top  (outside the outline)
D4  BLUE  [LED-0603]  96.6,-75.3 270 top  (outside the outline)
D5  BLUE  [LED-0603]  98.6,-75.3 270 top  (outside the outline)
D6  GREEN  [LED-0603]  10.5,75.7 0 top
D7  GREEN  [LED-0603]  65,81.3 270 top
D8  GREEN  [LED-0603]  67.5,82.6 90 top
D9  GREEN  [LED-0603]  85.3,78.46 180 top
D10  GREEN  [LED-0603]  85.3,76.1 180 top
D11  GREEN  [LED-0603]  85.3,73.6 180 top
FB1  30Ω/1.8A  [0603]  83.19,64.16 0 top
FB2  30Ω/1.8A  [0603]  -29.65,32.56 90 top  (outside the outline)
FB3  30Ω/1.8A  [0603]  22.4,-72.5 90 top  (outside the outline)
FB4  30Ω/1.8A  [0603]  124.2,-43.1 0 top  (outside the outline)
J1  ORESAT-DEBUG-CONNECTOR-CARD  [TE_2-1734592-0]  117.25,-45.75 180 top  (outside the outline)
J2  SM06B-SRSS-TB(LF)(SN)  [CONN_SM06B-SRSS-TB_JST]  86.7,59.5 0 bottom
J4  TFM-120-01-L-D-RA  [J-SAMTEC-TFM-120-X1-XXX-D-RA]  49.9,87.9 0 top
J5  2X1_TH_JUMPEP  [2X1]  66.2,59 270 top
J6  J-MOLEX-SMPM-73300-003X  [J-MOLEX-SMPM-073300-003X]  71.9,90.6 0 top
J7  DM3BT-DSF-PEJS  [DM3BT-DSF-PEJS]  127.43,-5.53 0 bottom  (outside the outline)
J8  FTSH-105-XX-X-DV-K  [CON10_2X5_DUK_FTSH]  -48.7,23.1 90 bottom  (outside the outline)
J9  U.FL-R-SMA  [U.FL-R-SMT]  76.7,21.1 0 top
J10  SM06B-SRSS-TB(LF)(SN)  [CONN_SM06B-SRSS-TB_JST]  -59.8,63.8 270 bottom  (outside the outline)
JP1  JUMPER-SMT_2_NO_SILK  [SMT-JUMPER_2_NO_SILK]  5.3,-51.4 0 bottom  (outside the outline)
JP100  JUMPER-SMT_2_NC_TRACE_SILK  [SMT-JUMPER_2_NC_TRACE_SILK]  21.75,43.76 0 bottom
JP101  JUMPER-SMT_2_NC_TRACE_SILK  [SMT-JUMPER_2_NC_TRACE_SILK]  35.62,52.23 90 bottom
JP104  JUMPER-SMT_2_NC_TRACE_SILK  [SMT-JUMPER_2_NC_TRACE_SILK]  37.75,52.26 90 bottom
JP105  JUMPER-SMT_3_1-NC_TRACE_SILK  [SMT-JUMPER_3_1-NC_TRACE_SILK]  -21.8,52.8 270 bottom  (outside the outline)
JP106  JUMPER-SMT_3_1-NC_TRACE_SILK  [SMT-JUMPER_3_1-NC_TRACE_SILK]  -18.8,52.8 270 bottom  (outside the outline)
JP107  JUMPER-SMT_3_1-NC_TRACE_SILK  [SMT-JUMPER_3_1-NC_TRACE_SILK]  -15.8,52.8 90 bottom  (outside the outline)
JP108  JUMPER-SMT_3_1-NC_TRACE_SILK  [SMT-JUMPER_3_1-NC_TRACE_SILK]  -12.8,52.8 90 bottom  (outside the outline)
JP109  JUMPER-SMT_3_1-NC_TRACE_SILK  [SMT-JUMPER_3_1-NC_TRACE_SILK]  -9.8,52.8 90 bottom  (outside the outline)
L1  6.8u  [ECS-MPI4040]  64.76,74.12 90 top
L2  6.8u  [ECS-MPI4040]  88.8,83.06 90 top
L7  1.7nH  [.0402-C-NOSILK]  77.15,33.3 180 top
L8  6.8nH  [.0805-C-NOSILK]  72.8,36.9 270 top
L9  1.0nH  [.0402-C-NOSILK]  76.7,45.5 90 top
L10  10nH  [INDC2928X203N]  71.6,40.4 180 top
PCB1  ORESAT-CARD-V1.3-GENERIC-1RF-POS1  [ORESAT-CARD-V1.3-GENERIC-1RF-POS1]  0,0 0 top
PCBA1  WF-NP9202WF  [WF-NP9202]  122.7,44.8 0 bottom  (outside the outline)
Q1  MMBT2907  [SOT23-BEC]  -20.94,36.75 180 top  (outside the outline)
Q2  PMV45EN  [SOT23]  39.47,69.9 180 top
Q3  DMP2240UDM  [SOT23-6]  25,70.9 90 top
Q4  PMV45EN  [SOT23]  39.5,75.96 0 top
Q5  MOSFET-PCH-SOT23-6  [SOT23-6]  51,80.4 90 top
Q6  MOSFET-PCH-SOT23-6  [SOT23-6]  40,81.4 90 top
R1  4.7k  [.0603-A]  90.6,-72.3 270 top  (outside the outline)
R2  4.7k  [.0603-A]  92.6,-72.3 270 top  (outside the outline)
R3  4.7k  [.0603-A]  94.6,-72.3 270 top  (outside the outline)
R4  4.7k  [.0603-A]  96.6,-72.3 270 top  (outside the outline)
R5  4.7k  [.0603-A]  98.6,-72.3 270 top  (outside the outline)
R6  10k  [.0603-A]  25.4,-78 0 top  (outside the outline)
R7  10k  [.0603-A]  88.5,66.8 90 top
R8  10k  [ARRAY_EXBA-M]  84.7,-26.1 0 bottom  (outside the outline)
R9  10K  [ARRAY_EXBA-M]  -24.05,3.95 90 top  (outside the outline)
R10  10K  [ARRAY_EXBA-M]  -16.15,3.85 90 top  (outside the outline)
R11  10k  [.0603-A]  88.78,78.46 0 top
R12  10k  [.0603-A]  79.58,81.66 90 top
R13  1M  [.0603-A]  31,39.42 270 top
R14  NP  [.0603-A]  77.67,81.66 270 top
R15  10k  [.0603-A]  32.66,45.19 180 top
R16  10k  [.0603-A]  68.8,58.1 180 top
R17  10k  [.0603-A]  68.8,52.6 180 top
R18  10k  [.0603-A]  82.2,45.7 270 top
R19  10k  [.0603-A]  -39.9,40.2 90 top  (outside the outline)
R20  10k  [.0603-A]  -38.3,40.2 270 top  (outside the outline)
R21  10k  [.0603-A]  88.8,76.1 180 top
R22  10k  [.0603-A]  10.71,58.73 90 top
R23  499  [.0603-A]  -20.89,39.7 180 top  (outside the outline)
R24  100K  [ARRAY_EXBA-M]  -18.8,52.8 90 top  (outside the outline)
R25  100K  [ARRAY_EXBA-M]  -11.3,52.8 90 top  (outside the outline)
R26  100K  [ARRAY_EXBA-M]  -27.9,53.25 180 top  (outside the outline)
R27  DNP  [.0603-A]  15.44,57.95 0 top
R28  10k  [.0603-A]  -23.5,38.8 270 top  (outside the outline)
R29  4.7k  [.0603-A]  88.8,71.3 180 top
R30  10k  [.0603-A]  88.8,73.6 180 top
R31  40.2K  [.0603-A]  -17.79,39.65 0 top  (outside the outline)
R32  10k  [.0603-A]  39.5,67.34 0 top
R33  100k  [.0603-A]  46,67.4 0 top
R34  10k  [.0603-A]  56,67.4 180 top
R35  665k  [.0603-A]  29,67.9 180 top
R36  1M  [.0603-A]  15,68.9 90 top
R37  330k  [.0603-A]  17,68.9 90 top
R38  10k  [.0603-A]  46,69.4 0 top
R39  10k  [.0603-A]  51,69.4 180 top
R40  NP  [.0603-A]  56,69.4 180 top
R41  100  [.0603-A]  29.5,69.9 180 top
R42  NP  [.0603-A]  51,71.4 180 top
R43  665k  [.0603-A]  29.5,71.9 180 top
R44  1M  [.0603-A]  15,72.9 270 top
R45  330k  [.0603-A]  17,72.9 270 top
R46  10k  [.0603-A]  39.5,72.96 180 top
R47  0  [.0603-A]  51,73.4 0 top
R48  100  [.0603-A]  29.5,73.9 180 top
R49  4.7k  [.0603-A]  10.5,72.89 0 top
R50  0  [.0603-A]  51,75.4 0 top
R51  4.7k  [.0603-A]  51,77.4 180 top
R52  10k  [.0603-A]  40,78.53 180 top
R53  NP  [.0603-A]  8.94,80.4 270 top
R54  10k  [.0603-A]  10.75,80.4 90 top
R55  10k  [.0603-A]  12.56,80.4 270 top
R56  NP  [.0603-A]  14.38,80.4 90 top
R57  10k  [.0603-A]  16.19,80.4 270 top
R58  NP  [.0603-A]  18,80.4 90 top
R59  DNP  [.0603-A]  11.7,-27.69 0 top  (outside the outline)
R60  DNP  [.0603-A]  11.7,-25.79 180 top  (outside the outline)
R61  10k  [.0603-A]  62.9,81.7 90 top
R62  10k  [.0603-A]  67.5,79.1 270 top
R63  100m  [R1206]  45.53,81.37 0 top
R64  10k  [.0603-A]  51,83.4 180 top
R65  NP  [.0603-A]  8.94,84.03 270 top
R66  NP  [.0603-A]  10.75,84.03 90 top
R67  NP  [.0603-A]  12.56,84.03 270 top
R68  NP  [.0603-A]  14.38,84.03 90 top
R69  NP  [.0603-A]  16.19,84.03 270 top
R70  NP  [.0603-A]  18,84.03 90 top
R71  100  [.0603-A]  28,86.9 180 top
R72  10k  [.0603-A]  28,88.9 180 top
R73  100  [.0603-A]  22.88,58.21 270 top
R74  100  [.0603-A]  24.44,58.21 270 top
R75  100  [.0603-A]  21.32,58.21 270 top
R76  10k  [.0603-A]  129.4,-40.3 90 top  (outside the outline)
R77  22  [.0603-A]  31.65,-33.45 0 top  (outside the outline)
R78  15k  [.0603-A]  31.65,-35.05 180 top  (outside the outline)
R79  22  [.0603-A]  34.95,-33.45 180 top  (outside the outline)
R80  0  [R0805]  70.1,34.4 270 top
R81  110  [.0402-B-NOSILK]  80,39.9 90 top
R82  220  [.0603-C-NOSILK]  71.1,45 180 top
R83  15k  [.0603-A]  34.95,-35.05 0 top  (outside the outline)
R84  3.3  [.0402-C-NOSILK]  76.7,36.5 90 top
R85  82.5  [.0603-A]  75.8,31.1 0 top
R86  93.1  [.0603-A]  76.7,28.1 270 top
R87  41.2  [.0603-A]  75.8,25.1 180 top
R88  41.2  [.0603-A]  72.6,25.1 180 top
R89  22  [.0603-A]  34.25,-29.95 90 top  (outside the outline)
R90  15k  [.0603-A]  35.85,-29.95 270 top  (outside the outline)
R91  22  [.0603-A]  34.25,-26.65 270 top  (outside the outline)
R92  15k  [.0603-A]  35.85,-26.65 90 top  (outside the outline)
R93  22  [.0603-A]  34.25,-23.15 90 top  (outside the outline)
R94  15k  [.0603-A]  35.85,-23.15 270 top  (outside the outline)
R95  22  [.0603-A]  34.25,-19.85 270 top  (outside the outline)
R96  15k  [.0603-A]  35.85,-19.85 90 top  (outside the outline)
R97  10k  [.0603-A]  26.55,-35.35 90 top  (outside the outline)
R98  1.5k  [.0603-A]  25.45,-22.15 0 top  (outside the outline)
R99  10k  [.0603-A]  28.15,-35.35 90 top  (outside the outline)
R100  15k  [.0603-A]  20.65,-31.15 270 top  (outside the outline)
R101  15k  [.0603-A]  23.75,-34.45 0 top  (outside the outline)
RT2  TDK NTCG163JX103DT1S  [0603-THERMISTOR-B]  80,42.6 180 top
TP1  TEST-POINT  [2MM-TEST-POINT]  31.65,-21.25 90 top  (outside the outline)
TP2  TEST-POINT3X4  [PAD.03X.04]  19.45,33.36 90 top
TP3  TEST-POINT3X4  [PAD.03X.04]  17.85,44.66 0 bottom
TP4  TEST-POINT3X4  [PAD.03X.04]  12.89,34.55 90 top
TP5  TEST-POINT  [2MM-TEST-POINT]  77.2,85.8 0 top
TP6  TEST-POINT  [2MM-TEST-POINT]  77.2,88 0 top
TP7  TEST-POINT  [2MM-TEST-POINT]  94.6,78.3 0 top
TP8  TEST-POINT  [2MM-TEST-POINT]  -7,42.1 270 top  (outside the outline)
TP9  TEST-POINT3X4  [PAD.03X.04]  20.35,45.76 0 bottom
TP10  TEST-POINT  [2MM-TEST-POINT]  82.2,43.2 0 bottom
TP11  TEST-POINT  [2MM-TEST-POINT]  67.9,50.5 0 top
TP12  TEST-POINT3X4  [PAD.03X.04]  29.25,40.96 0 bottom
TP13  TEST-POINT  [2MM-TEST-POINT]  129.8,-46.2 0 top  (outside the outline)
TP14  TEST-POINT3X4  [PAD.03X.04]  5.8,-53.9 90 top  (outside the outline)
TP15  TEST-POINT  [2MM-TEST-POINT]  91.19,66.86 270 top
TP16  TEST-POINT3X4  [PAD.03X.04]  22.45,-32.45 0 top  (outside the outline)
TP17  TEST-POINT3X4  [PAD.03X.04]  24.85,-29.85 0 bottom  (outside the outline)
TP18  TEST-POINT3X4  [PAD.03X.04]  28.75,-28.25 0 bottom  (outside the outline)
TP19  TEST-POINT3X4  [PAD.03X.04]  27.15,-29.85 0 bottom  (outside the outline)
TP20  TEST-POINT3X4  [PAD.03X.04]  25.95,-28.25 0 bottom  (outside the outline)
TP22  TEST-POINT3X4  [PAD.03X.04]  81.75,-28.68 270 bottom  (outside the outline)
TP25  TEST-POINT3X4  [PAD.03X.04]  8.42,69.58 0 top
TP30  TEST-POINT3X4  [PAD.03X.04]  11.87,56.44 0 bottom
TP31  TEST-POINT3X4  [PAD.03X.04]  -40.5,42.3 180 top  (outside the outline)
TP35  TEST-POINT3X4  [PAD.03X.04]  8.2,66.2 0 top
TP38  TEST-POINT3X4  [PAD.03X.04]  19.77,57.61 0 top
TP39  TEST-POINT3X4  [PAD.03X.04]  19.69,60.36 0 top
TP40  TEST-POINT3X4  [PAD.03X.04]  12.7,66.2 0 top
TP41  TEST-POINT  [2MM-TEST-POINT]  23,65.9 0 top
TP42  TEST-POINT  [2MM-TEST-POINT]  26,65.9 0 top
TP43  TEST-POINT  [2MM-TEST-POINT]  29,65.9 0 top
TP44  TEST-POINT  [2MM-TEST-POINT]  32.7,71.1 0 top
TP45  TEST-POINT  [2MM-TEST-POINT]  36.5,66.9 0 top
TP46  TEST-POINT  [2MM-TEST-POINT]  61.8,67.4 0 top
TP47  TEST-POINT  [2MM-TEST-POINT]  35,69.9 0 top
TP48  TEST-POINT  [2MM-TEST-POINT]  63,70.4 270 top
TP49  TEST-POINT  [2MM-TEST-POINT]  66,70.9 270 top
TP50  TEST-POINT  [2MM-TEST-POINT]  35,72.9 0 top
TP51  TEST-POINT  [2MM-TEST-POINT]  31,75.9 0 top
TP52  TEST-POINT  [2MM-TEST-POINT]  35,75.9 0 top
TP53  TEST-POINT  [2MM-TEST-POINT]  31,78.9 0 top
TP54  TEST-POINT  [2MM-TEST-POINT]  35,78.9 0 top
TP55  TEST-POINT  [2MM-TEST-POINT]  56,79.9 0 top
TP56  TEST-POINT  [2MM-TEST-POINT]  31,81.9 0 top
TP57  TEST-POINT  [2MM-TEST-POINT]  35,81.9 0 top
TP58  TEST-POINT3X4  [PAD.03X.04]  55.5,83.9 270 top
TP59  TEST-POINT3X4  [PAD.03X.04]  57.5,83.9 270 top
TP60  TEST-POINT3X4  [PAD.03X.04]  59.5,83.9 270 top
TP61  TEST-POINT3X4  [PAD.03X.04]  61.5,83.9 270 top
TP62  TEST-POINT3X4  [PAD.03X.04]  63.5,83.9 270 top
TP63  TEST-POINT  [2MM-TEST-POINT]  31,84.9 0 top
TP64  TEST-POINT  [2MM-TEST-POINT]  35,84.9 0 top
TP65  TEST-POINT  [2MM-TEST-POINT]  20.94,86.03 0 top
TP66  TEST-POINT  [2MM-TEST-POINT]  23.44,86.03 0 top
TP67  TEST-POINT  [2MM-TEST-POINT]  24,74.9 0 top
TP68  TEST-POINT  [2MM-TEST-POINT]  26.5,74.9 0 top
TP69  TEST-POINT3X4  [PAD.03X.04]  29.4,58.41 0 bottom
TP100  TEST-POINT3X4  [PAD.03X.04]  21.91,35.12 0 bottom
TP101  TEST-POINT3X4  [PAD.03X.04]  23.91,35.12 0 bottom
TP102  TEST-POINT3X4  [PAD.03X.04]  25.89,35.52 0 bottom
TP103  TEST-POINT3X4  [PAD.03X.04]  27.75,34.76 0 bottom
TP104  TEST-POINT3X4  [PAD.03X.04]  12.59,37.12 0 bottom
TP105  TEST-POINT3X4  [PAD.03X.04]  15.1,35.23 0 bottom
TP106  TEST-POINT3X4  [PAD.03X.04]  16.91,35.23 0 bottom
TP107  TEST-POINT3X4  [PAD.03X.04]  18.76,35.23 0 bottom
TP108  TEST-POINT3X4  [PAD.03X.04]  29,35.23 0 bottom
TP109  TEST-POINT3X4  [PAD.03X.04]  14.3,-51.9 0 bottom  (outside the outline)
TP110  TEST-POINT3X4  [PAD.03X.04]  13.24,-51.12 0 bottom  (outside the outline)
TP111  TEST-POINT3X4  [PAD.03X.04]  29.97,36.26 0 bottom
TP112  TEST-POINT3X4  [PAD.03X.04]  108.95,-38.5 180 bottom  (outside the outline)
TP114  TEST-POINT3X4  [PAD.03X.04]  27.59,37.17 0 bottom
TP115  TEST-POINT3X4  [PAD.03X.04]  16.84,37.7 0 bottom
TP117  TEST-POINT3X4  [PAD.03X.04]  29.03,38.11 0 bottom
TP118  TEST-POINT3X4  [PAD.03X.04]  22.53,38.14 0 bottom
TP120  TEST-POINT3X4  [PAD.03X.04]  18.56,38.42 0 bottom
TP121  TEST-POINT3X4  [PAD.03X.04]  19.72,38.45 90 bottom
TP122  TEST-POINT3X4  [PAD.03X.04]  13.6,39.73 0 bottom
TP123  TEST-POINT3X4  [PAD.03X.04]  14.34,38.73 0 bottom
TP124  TEST-POINT3X4  [PAD.03X.04]  15.76,38.73 0 bottom
TP125  TEST-POINT3X4  [PAD.03X.04]  27.18,39.36 0 bottom
TP126  TEST-POINT3X4  [PAD.03X.04]  23.88,39.67 0 bottom
TP127  TEST-POINT3X4  [PAD.03X.04]  10.49,39.38 0 bottom
TP128  TEST-POINT3X4  [PAD.03X.04]  8.85,39.16 0 bottom
TP129  TEST-POINT3X4  [PAD.03X.04]  17.09,40.51 90 bottom
TP130  TEST-POINT3X4  [PAD.03X.04]  19.25,40.51 90 bottom
TP131  TEST-POINT3X4  [PAD.03X.04]  11.53,41.94 0 bottom
TP132  TEST-POINT3X4  [PAD.03X.04]  12.81,40.7 90 bottom
TP134  TEST-POINT3X4  [PAD.03X.04]  8.35,40.56 0 bottom
TP135  TEST-POINT3X4  [PAD.03X.04]  31.26,43.56 0 bottom
TP136  TEST-POINT3X4  [PAD.03X.04]  26.96,40.66 90 bottom
TP137  TEST-POINT3X4  [PAD.03X.04]  30.46,42.48 0 bottom
TP138  TEST-POINT3X4  [PAD.03X.04]  29.25,42.76 0 bottom
TP139  TEST-POINT3X4  [PAD.03X.04]  28.31,43.84 0 bottom
TP140  TEST-POINT3X4  [PAD.03X.04]  12.75,43.76 90 bottom
TP141  TEST-POINT3X4  [PAD.03X.04]  27.12,44.26 0 bottom
TP142  TEST-POINT3X4  [PAD.03X.04]  108.95,-41.3 0 bottom  (outside the outline)
TP143  TEST-POINT3X4  [PAD.03X.04]  24.91,46.07 0 bottom
TP144  TEST-POINT3X4  [PAD.03X.04]  22.51,45.5 0 bottom
TP145  TEST-POINT3X4  [PAD.03X.04]  12.91,45.76 0 bottom
TP146  TEST-POINT3X4  [PAD.03X.04]  109.95,-40.6 0 bottom  (outside the outline)
TP148  TEST-POINT3X4  [PAD.03X.04]  26.56,46.08 0 bottom
TP149  TEST-POINT3X4  [PAD.03X.04]  27.75,46.08 0 bottom
TP150  TEST-POINT3X4  [PAD.03X.04]  16.75,46.76 0 bottom
TP151  TEST-POINT3X4  [PAD.03X.04]  109.95,-39.2 0 bottom  (outside the outline)
TP152  TEST-POINT3X4  [PAD.03X.04]  12.05,48.16 0 bottom
TP153  TEST-POINT3X4  [PAD.03X.04]  13.15,48.96 0 bottom
TP154  TEST-POINT3X4  [PAD.03X.04]  13.75,47.26 0 bottom
TP155  TEST-POINT3X4  [PAD.03X.04]  108.95,-39.9 0 bottom  (outside the outline)
TP156  TEST-POINT3X4  [PAD.03X.04]  13.75,50.06 0 bottom
TP157  TEST-POINT3X4  [PAD.03X.04]  14.75,48.26 0 bottom
TP158  TEST-POINT3X4  [PAD.03X.04]  28.47,49.2 0 bottom
TP159  TEST-POINT3X4  [PAD.03X.04]  8.65,50.36 0 bottom
TP160  TEST-POINT3X4  [PAD.03X.04]  26.09,49.54 0 bottom
TP161  TEST-POINT3X4  [PAD.03X.04]  21.75,49.76 90 bottom
TP162  TEST-POINT3X4  [PAD.03X.04]  10.61,48.99 0 bottom
TP164  TEST-POINT3X4  [PAD.03X.04]  37.75,50.04 90 bottom
TP165  TEST-POINT3X4  [PAD.03X.04]  35.62,50.08 90 bottom
TP166  TEST-POINT3X4  [PAD.03X.04]  24.25,50.76 0 bottom
TP167  TEST-POINT3X4  [PAD.03X.04]  12.78,50.69 90 bottom
TP169  TEST-POINT3X4  [PAD.03X.04]  20.25,51.26 0 bottom
TP171  TEST-POINT3X4  [PAD.03X.04]  19.16,54.08 0 bottom
TP172  TEST-POINT3X4  [PAD.03X.04]  21.75,51.76 0 bottom
TP173  TEST-POINT3X4  [PAD.03X.04]  13.75,52.26 0 bottom
TP174  TEST-POINT3X4  [PAD.03X.04]  24.25,52.26 0 bottom
TP175  TEST-POINT3X4  [PAD.03X.04]  14.94,52.33 0 bottom
TP176  TEST-POINT3X4  [PAD.03X.04]  15.75,54.86 0 bottom
TP177  TEST-POINT3X4  [PAD.03X.04]  23.75,53.54 0 bottom
TP178  TEST-POINT3X4  [PAD.03X.04]  24.97,53.54 0 bottom
TP180  TEST-POINT3X4  [PAD.03X.04]  13.75,53.89 0 bottom
TP181  TEST-POINT3X4  [PAD.03X.04]  14.94,53.89 0 bottom
TP183  TEST-POINT3X4  [PAD.03X.04]  40,84.4 0 bottom
TP184  TEST-POINT3X4  [PAD.03X.04]  42,84.4 0 bottom
U1  RCLAMP0504FB  [SC70-6]  -30.05,28.66 0 top  (outside the outline)
U2  TUSB2046IBVF  [QFP80P900X900X160-32N]  26.75,-28.35 90 top  (outside the outline)
U3  THGBMJG7C2LBAU8  [BGA-153(11.5X13)(EMMC-BA)]  -20.75,14.85 180 top  (outside the outline)
U4  SN74LVC1G07DCK  [C70(TI-DCK)]  10.8,-52.9 270 top  (outside the outline)
U5  TPS62112  [S-PVQFN-16]  83.17,83.06 270 top
U6  SN74LVC1G32QDBVRQ1  [DBV5]  68.8,55.3 0 top
U7  OSD3358-512M-BSM  [OSD335X-BGA-256]  19.25,45.76 270 top
U8  MIC94090YC6-TR  [SC-70-6_MCH]  72.8,55.7 180 top
U9  TPS2041BQDBVRQ1  [DBV5]  25.4,-75.3 0 top  (outside the outline)
U10  TLVH431  [SOT23-3]  -17.79,36.75 180 top  (outside the outline)
U11  TCAN330  [SOT23-8_TI-DCN]  10.4,67.7 180 top
U12  MIC842LYC5  [SC70-5]  19.5,68.9 180 top
U13  MIC842LYC5  [SC70-5]  19.5,72.9 180 top
U14  MAX4211FETE  [QFN65P400X400X80-17T210]  46,73.9 0 top
U15  TPS62112  [S-PVQFN-16]  59.46,74.12 270 top
U16  MAX7310ATE  [QFN65P400X400X80-17T210]  26.5,81.4 0 top
U17  25AAXX  [SOIC8]  34.5,57.29 0 bottom
U18  RCLAMP0504FB  [SC70-6]  26.55,60.76 270 top
U19  TQP9111  [QFN50P400X400X102-21N]  76.7,40.4 90 top
U20  TPS2041BQDBVRQ1  [DBV5]  85.8,66.8 90 top
U21  TPS2041BQDBVRQ1  [DBV5]  126.7,-40.3 90 top  (outside the outline)
U$1  3X1_TH_JUMPER  [3X1]  -47.55,58.85 180 top  (outside the outline)
U$2  [FIDUCIAL_G10]  6,88 0 top
U$3  [PSAS_LOGO_10X10]  90.3,52 0 top
U$4  [FLIGHTMARKER_NEW_BOARDS]  96.2,10.35 90 top
U$5  [FIDUCIAL_G10]  6,9 0 top
U$6  [FIDUCIAL_G10]  94,9 0 top
Y1  24MHz  [5X3.2-4SMD]  34.01,39.42 90 top
Y2  ABS07-32.768KHZ-T  [CRYSTAL_3.2X1.5]  15.44,60.08 0 top
Y3  6MHz  [ECS_ECS-060-18-20BM-JEN-TR]  26.15,-18.35 180 top  (outside the outline)